# EAGLE design daq_daughter (EAGLE 9.6.2)
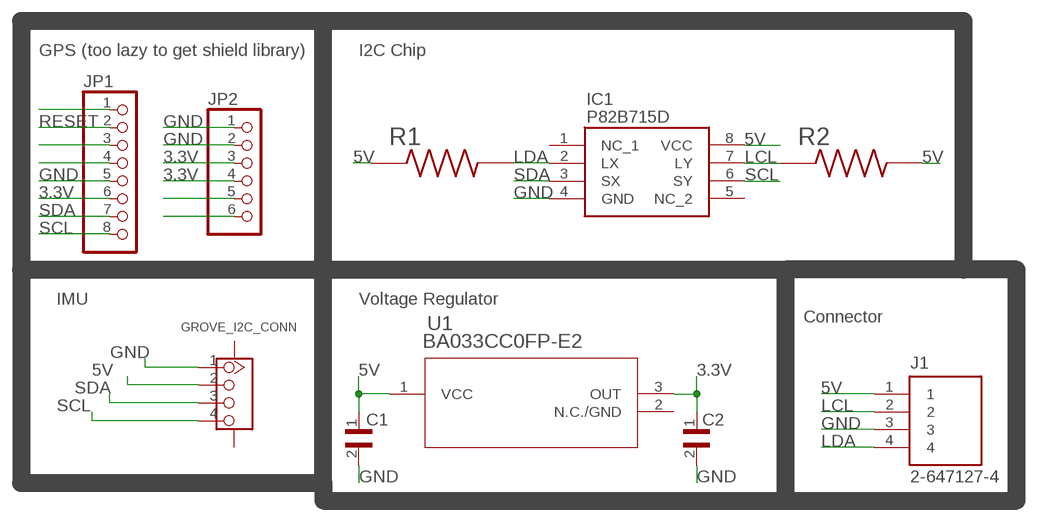
[diagram p0: schematic, sheet 1]

## Parts
C1  C3216X5R1E106M085AC  [CAPC3216X100N]
C2  C3216X5R1E106M085AC  [CAPC3216X100N]
GROVE_I2C_CONN  CONNECTOR-NEW_GROVE-CONNECTOR-SMDDD  [CONNECTOR-NEW_HW4-SMD-2.0]
IC1  P82B715D  [SOIC127P600X175-8N]
J1  2-647127-4  [TE_2-647127-4]
JP1  PINHD-1X8M  [1X08M]
JP2  PINHD-1X6M  [1X06M]
R1  RMCF1206JT10K0  [RESC3216X70N]
R2  RMCF1206JT10K0  [RESC3216X70N]
U1  BA033CC0FP-E2  [TO252-3_ROM]

## Nets
3.3V: C2.1 JP1.6 JP2.3 JP2.4 U1.3(OUT)
5V: C1.1 GROVE_I2C_CONN.2 IC1.8(VCC) J1.1 R1.1 R2.2 U1.1(VCC)
GND: C1.2 C2.2 GROVE_I2C_CONN.1 IC1.4(GND) J1.3 JP1.5 JP2.1 JP2.2
LCL: IC1.7(LY) J1.2 R2.1
LDA: IC1.2(LX) J1.4 R1.2
N$14: JP2.6
N$16: JP1.1
N$17: JP1.3
N$18: JP1.4
N$19: JP2.5
RESET: JP1.2
SCL: GROVE_I2C_CONN.4 IC1.6(SY) JP1.8
SDA: GROVE_I2C_CONN.3 IC1.3(SX) JP1.7
Unconnected: GROVE_I2C_CONN.SS1 GROVE_I2C_CONN.SS2 IC1.1(NC_1) IC1.5(NC_2) U1.2(N.C./GND)

## Notes on the sheet
- GPS (too lazy to get shield library) | I2C Chip
- IMU | Voltage Regulator
- Connector

## Library data of the parts
C1 C2 = C3216X5R1E106M085AC:C3216X5R1E106M085AC: CAP CER 10UF 25V X5R 1206; DESCRIPTION: Cap Ceramic 10uF 25V X5R 20% SMD 1206 85°C Punched Paper T/R; DIGI-KEY_PART_NUMBER: 445-14678-1-ND; MF: TDK; MP: C3216X5R1E106M085AC; PACKAGE: 3216 TDK; PURCHASE-URL: https://pricing.snapeda.com/search/part/C3216X5R1E106M085AC/?ref=eda
GROVE_I2C_CONN = Grove - IMU 10DOF v2.0:CONNECTOR-NEW_GROVE-CONNECTOR-SMD: 4P-SMD-2.0:320110030;4P-SMD-2.0-90D:320110032
IC1 = SamacSys_Parts:P82B715D: Texas Instruments P82B715D, Dual, Bus Buffer, 4.5 12 V, 8-Pin SOIC Source: Datasheet <http://componentsearchengine.com/Datasheets/3/P82B715D.pdf>; DESCRIPTION: Texas Instruments P82B715D, Dual, Bus Buffer, 4.5 12 V, 8-Pin SOIC; HEIGHT: 1.75mm; MANUFACTURER_NAME: Texas Instruments; MANUFACTURER_PART_NUMBER: P82B715D; MOUSER_PART_NUMBER: 595-P82B715D; MOUSER_PRICE-STOCK: https://www.mouser.co.uk/ProductDetail/Texas-Instruments/P82B715D?qs=ToK3%2FczOkx%2Fmhyx%252Bp5%2FQZw%3D%3D
J1 = 2-647127-4:2-647127-4; CENTERLINE_PITCH: 3.96 mm[.156 in]; COMMENT: 2-647127-4; DESCRIPTION: 04P MTA156 SHRD HDR ASSY LF; DIGI-KEY_PART_NUMBER: A122823-ND; EU_ROHS_COMPLIANCE: Compliant; MF: TE Connectivity; MP: 2-647127-4; NUMBER_OF_POSITIONS: 4; PACKAGE: None; PRODUCT_TYPE: Header; PURCHASE-URL: https://pricing.snapeda.com/search/part/2-647127-4/?ref=eda
JP1 = pinhead:PINHD-1X8: PIN HEADER
JP2 = pinhead:PINHD-1X6: PIN HEADER
R1 R2 = RMCF1206JT10K0:RMCF1206JT10K0; DESCRIPTION: 10 kOhms ±5% 0.25W, 1/4W Chip Resistor 1206 (3216 Metric) Automotive AEC-Q200 Thick Film; DIGI-KEY_PART_NUMBER: RMCF1206JT10K0CT-ND; MF: Stackpole Electronics Inc; MP: RMCF1206JT10K0; PACKAGE: 3216 Stackpole; PURCHASE-URL: https://pricing.snapeda.com/search/part/RMCF1206JT10K0/?ref=eda
U1 = BA033CC0FP-E2:BA033CC0FP-E2; COPYRIGHT: Copyright (C) 2022 Ultra Librarian. All rights reserved.; DIGI-KEY_PART_NUMBER_1: BA033CC0FP-E2TR-ND; DIGI-KEY_PART_NUMBER_2: BA033CC0FP-E2CT-ND; DIGI-KEY_PART_NUMBER_3: BA033CC0FP-E2DKR-ND; MANUFACTURER_PART_NUMBER: BA033CC0FP-E2; MFR_NAME: ROHM Semiconductor

## Board
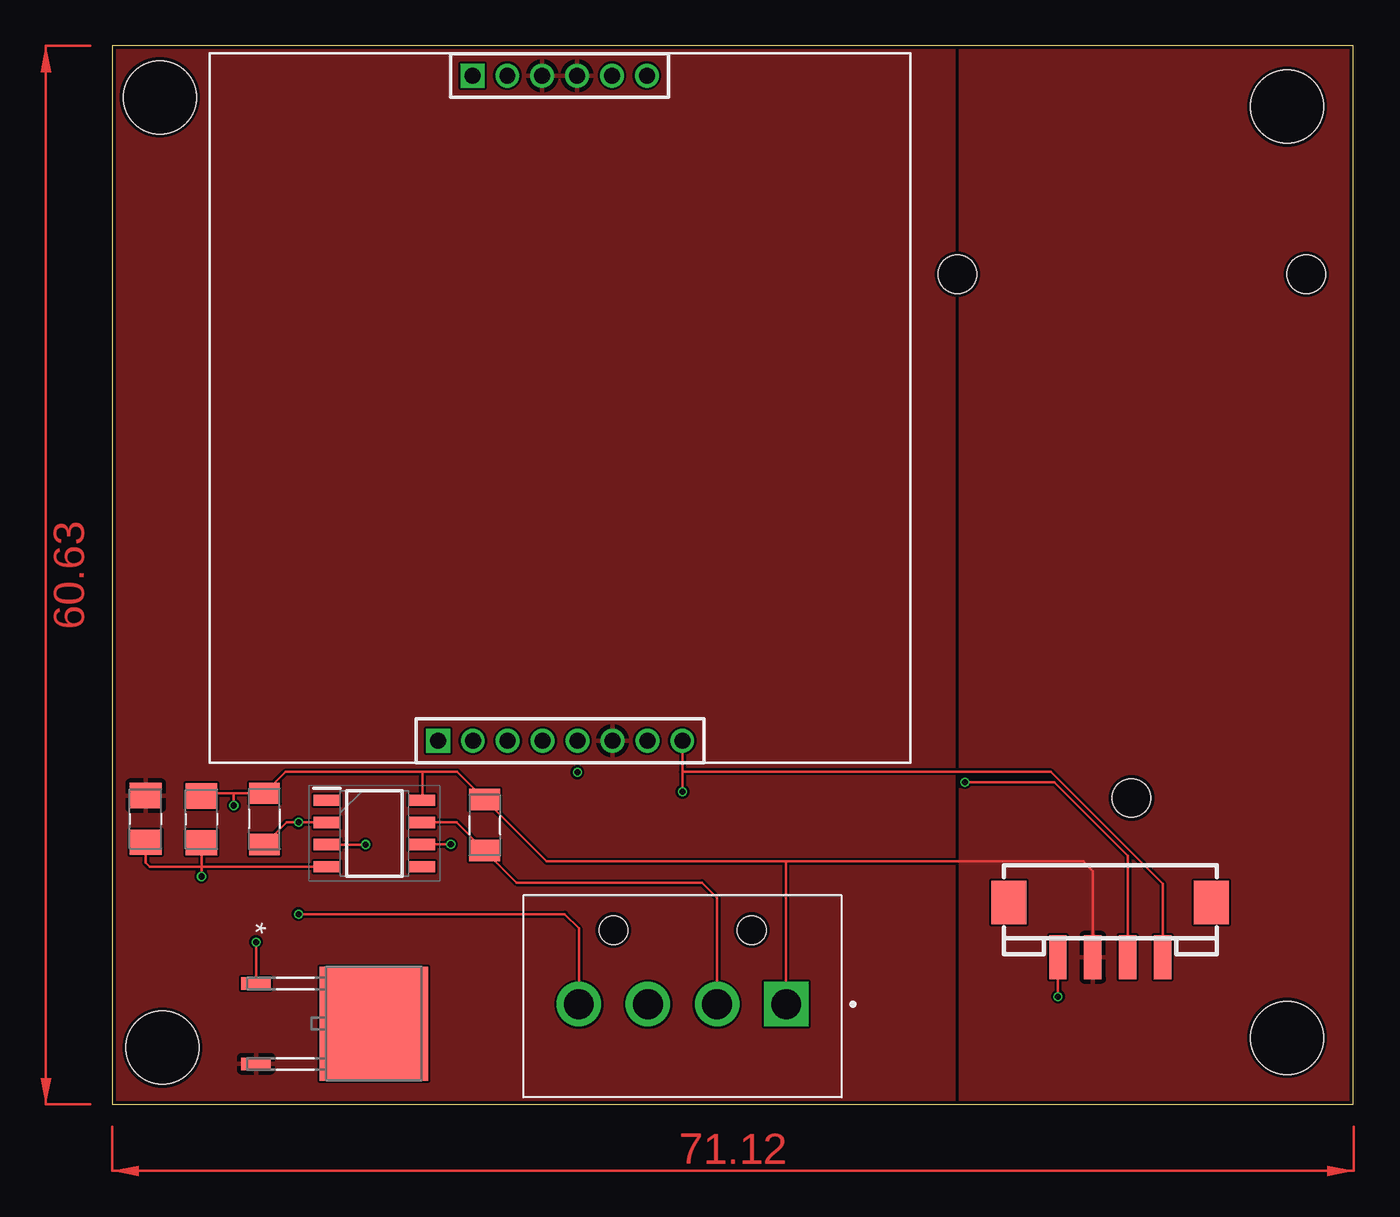
[diagram p1: board, top side]
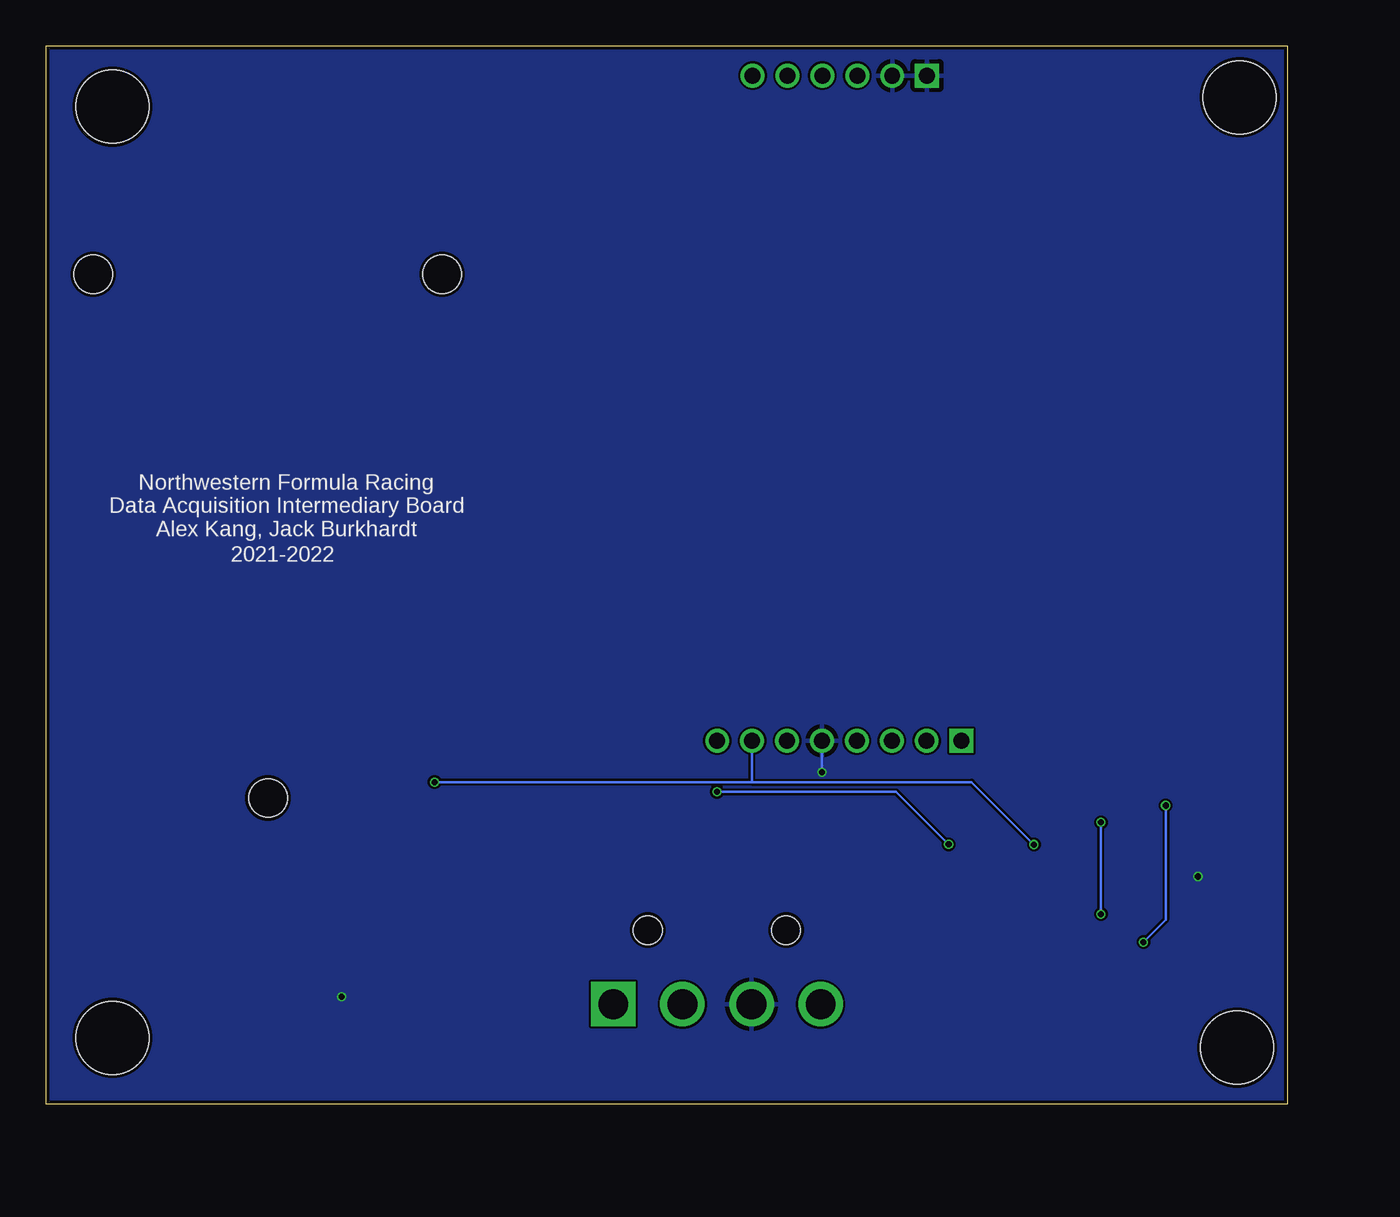
[diagram p2: board, bottom side, seen from below]

Size 71.1 x 60.63 mm. Coordinates in mm from the lower left corner, seen from the top.
Outline: 0,0 71.1,0 71.1,60.63 0,60.63 0,0
Copper layers (1*16): Top 0.035559375mm / dielectric 1.6mm / Bottom 0.035559375mm
Design rules "jlcpcb2layer": minimum track width 5mil, minimum drill 12mil, track to track 5mil, track to pad 5mil, pad to pad 5mil, via to via 5mil, smd to smd 5mil, copper to edge 8mil, drill to drill 6mil, minimum pad ring 5mil, minimum via ring 3mil, stop-mask expansion 2.5mil, vias tented up to drill 0mil, thermal gap 10mil
Holes 2.18 mm at 48.41,47.55 68.4,47.55 58.39,17.55
Holes 4.17 mm at 67.31,3.81 67.31,57.15 2.72,57.68 2.87,3.25

### Footprints (pad centres in the part's own frame; a part is rotated, then mirrored left to right if it is on the bottom)
CAPC3216X100N = smd 1.44 x 1.82: 1 -1.336,0; 2 1.336,0
CONNECTOR-NEW_HW4-SMD-2.0 = smd 1 x 2.5: 1 -3,0; 2 -1,0; 3 1,0; 4 3,0 | smd 2 x 2.5: SS1 -5.8,3.123; SS2 5.8,3.123
SOIC127P600X175-8N = smd 1.525 x 0.65: 1 -2.712,1.905; 2 -2.712,0.635; 3 -2.712,-0.635; 4 -2.712,-1.905; 5 2.712,-1.905; 6 2.712,-0.635; 7 2.712,0.635; 8 2.712,1.905
TE_2-647127-4 = drill 1.7 pad 2.05 square: 1 0,0 | drill 1.7 pad 2.05: 2 -3.96,0; 3 -7.92,0; 4 -11.88,0 | hole 1.63: -9.9,4.24; -1.98,4.24
1X08M = drill 0.914 square: 1 -7,0 | drill 0.914: 2 -5,0; 3 -3,0; 4 -1,0; 5 1,0; 6 3,0; 7 5,0; 8 7,0
1X06M = drill 0.914 square: 1 -5,0 | drill 0.914: 2 -3,0; 3 -1,0; 4 1,0; 5 3,0; 6 5,0
RESC3216X70N = smd 1.23 x 1.77: 1 -1.466,0; 2 1.466,0
TO252-3_ROM = smd 0.711 x 1.702: 1 -2.3,-6.756; 3 2.3,-6.756 | smd 6.553 x 6.223: 2 0,0

### Placement (x,y rotation side)
C1  5.11,16.33 270 top
C2  1.91,16.36 270 top
GROVE_I2C_CONN  57.18,8.43 0 top
IC1  15.01,15.52 0 top
J1  38.61,5.74 0 top
JP1  25.65,20.83 0 top
JP2  25.63,58.93 0 top
R1  8.71,16.36 270 top
R2  21.34,16 90 top
U1  14.99,4.62 270 top

### Tracks (layer width: path | path; a pad name or v marks a point on that pad's centre or on a via)
3.3V
  pour Top: 0,60.96 0,0 48.26,0 48.26,60.96
5V  (via drill 0.35)
  Top 0.152: 38.61,13.91 55.63,13.91 56.18,13.37 GROVE_I2C_CONN.2 | 17.78,19.05 9.94,19.05 R1.1 6.96,17.82 | 17.78,19.05 19.75,19.05 R2.2 24.89,13.91 38.61,13.91 | IC1.8 17.78,17.48 17.78,19.05 | J1.1 38.61,13.91 | C1.1 5.26,17.82 6.96,17.82 | v6.96,17.12 6.96,17.82 | v8.23,9.3 U1.1
  Bottom 0.152: v6.96,17.12 6.96,10.57 v8.23,9.3
  pour Top: 48.56,60.96 48.56,0 71.12,0 71.12,60.96
GND  (via drill 0.35)
  Top 0.152: IC1.4 5.11,13.61 | 5.11,13.61 v5.11,13.06 | C2.2 1.91,13.84 2.13,13.61 5.11,13.61 | C1.2 5.11,13.61 | GROVE_I2C_CONN.1 v54.18,6.17
  Bottom 0.152: JP1.5 26.65,19.03 v26.64,19.02
  pour Bottom: 0,60.96 0,0 71.12,0 71.12,60.96
LCL
  Top 0.152: IC1.7 19.72,16.15 R2.1 23.17,12.7 33.78,12.7 34.65,11.83 J1.2
LDA  (via drill 0.35)
  Top 0.152: R1.2 9.97,16.15 v10.67,16.15 IC1.2 | v10.67,10.9 25.91,10.9 26.73,10.08 J1.4
  Bottom 0.152: v10.67,10.9 v10.67,16.15
SCL  (via drill 0.35)
  Top 0.152: JP1.8 32.66,20.82 32.66,19.05 | 32.66,19.05 v32.66,17.91 | GROVE_I2C_CONN.4 60.18,12.65 53.78,19.05 32.66,19.05 | IC1.6 17.74,14.9 v19.39,14.9
  Bottom 0.152: v19.39,14.9 22.4,17.91 v32.66,17.91
SDA  (via drill 0.35)
  Top 0.152: IC1.3 v14.5,14.88 | v48.85,18.46 53.97,18.46 58.18,14.25 GROVE_I2C_CONN.3
  Bottom 0.152: 30.65,18.46 JP1.7 | 30.65,18.46 v48.85,18.46 | 30.65,18.46 18.08,18.46 v14.5,14.88
(copper drawn outside any net)
  shapes: Top area x2

### Text on the board
bPlace: Northwestern Formula Racing | Data Acquisition Intermediary Board | Alex Kang, Jack Burkhardt | 2021-2022